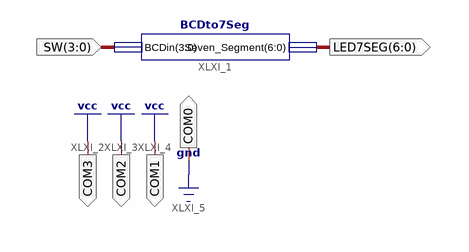
[diagram p0: schematic sheet 1]
// Xilinx ISE schematic Main.sch (spartan6) as structural Verilog: 1 symbols, 6 ports
module Main (
  input  [3:0] SW,
  output [6:0] LED7SEG,
  output COM3,
  output COM2,
  output COM1,
  output COM0
);

  BCDto7Seg XLXI_1 (.BCDin(SW), .Seven_Segment(LED7SEG));

  assign COM0 = 1'b0;
  assign COM1 = 1'b1;
  assign COM2 = 1'b1;
  assign COM3 = 1'b1;

  // Notes on the sheet:
  //   LOC on signal SW(3:0) = P59,P61,P62,P66
  //   LOC on signal LED7SEG(6:0) = P41,P40,P35,P34,P32,P29,P27
  //   LOC on signal COM3 = P30
  //   LOC on signal COM2 = P33
  //   LOC on signal COM1 = P43
  //   LOC on signal COM0 = P44
endmodule
